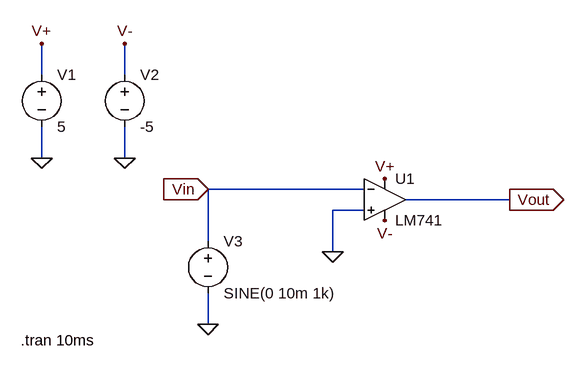
[diagram p0: schematic Task 1.asc]
Task 1.asc, the LTspice schematic file:
Version 4.1
SHEET 1 880 680
WIRE -432 -16 -432 -64
WIRE -304 -16 -304 -64
WIRE -432 112 -432 64
WIRE -304 112 -304 64
WIRE 64 160 -176 160
WIRE 288 176 128 176
WIRE 64 192 16 192
WIRE -176 240 -176 160
WIRE 16 256 16 192
WIRE -176 368 -176 320
FLAG -304 112 0
FLAG -432 112 0
FLAG 16 256 0
FLAG -176 368 0
FLAG -176 160 Vin
IOPIN -176 160 In
FLAG 288 176 Vout
IOPIN 288 176 Out
FLAG 96 144 V+
FLAG 96 208 V-
FLAG -304 -64 V-
FLAG -432 -64 V+
SYMBOL LM741\\LM741\\LM741 96 112 R0
SYMATTR InstName U1
SYMBOL voltage -432 -32 R0
WINDOW 123 0 0 Left 0
WINDOW 39 0 0 Left 0
SYMATTR InstName V1
SYMATTR Value 5
SYMBOL voltage -304 -32 R0
WINDOW 123 0 0 Left 0
WINDOW 39 0 0 Left 0
SYMATTR InstName V2
SYMATTR Value -5
SYMBOL voltage -176 224 R0
WINDOW 123 0 0 Left 0
WINDOW 39 0 0 Left 0
SYMATTR InstName V3
SYMATTR Value SINE(0 10m 1k)
TEXT -464 392 Left 2 !.tran 10ms

The netlist it stands for:
* Task 1.asc
X§U1 0 Vin V+ V- Vout LM741  ; pins In+ In- V+ V- OUT
V1 V+ 0 5
V2 V- 0 -5
V3 Vin 0 SINE(0 10m 1k)
.tran 10ms
.lib LM741.lib
.backanno
.end